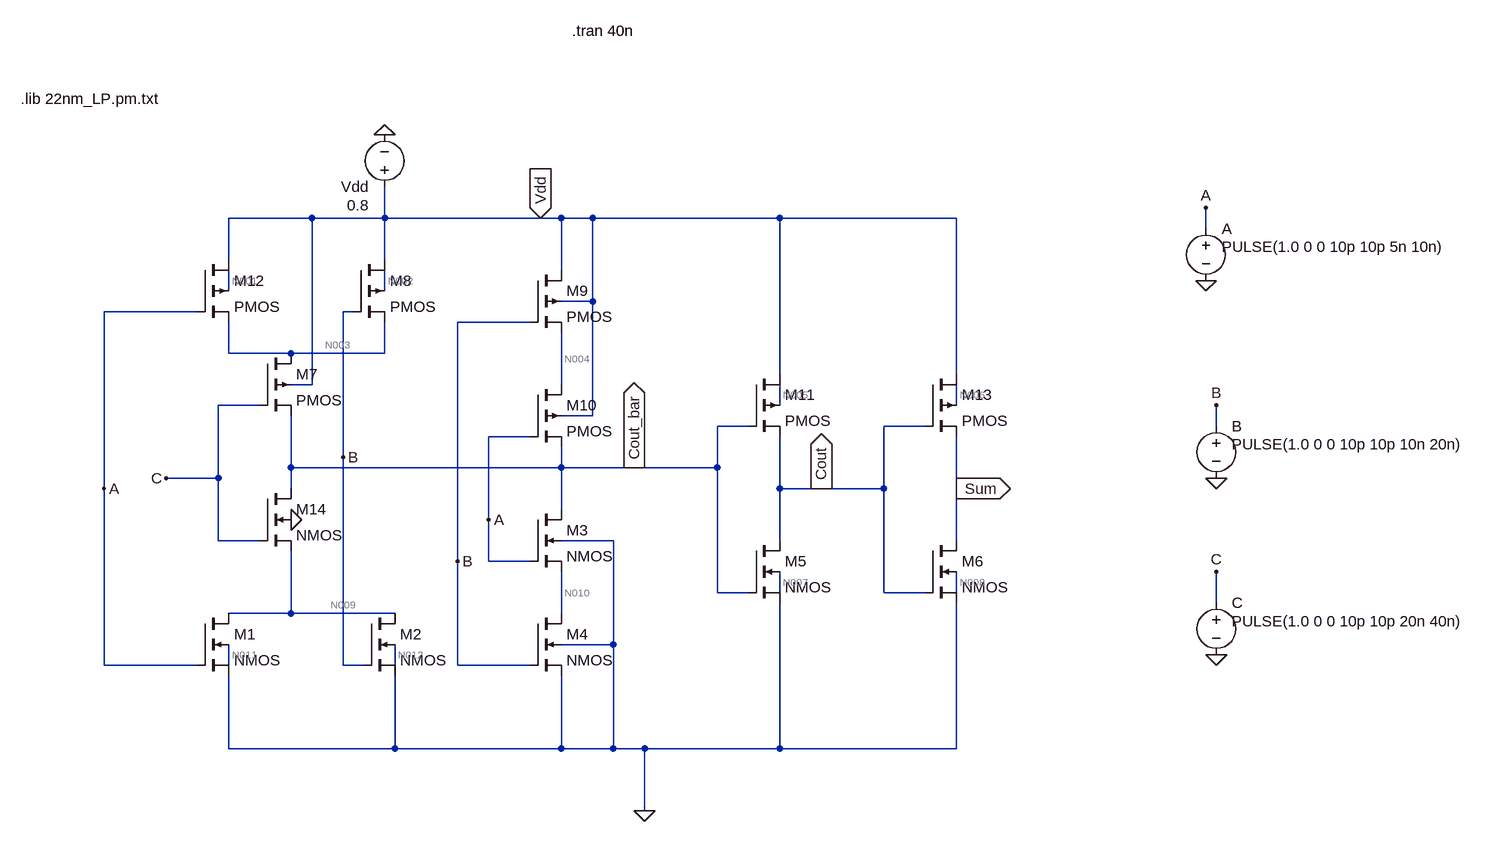
[diagram p0: schematic AMA2_22nm.asc]
AMA2_22nm.asc, the LTspice schematic file:
Version 4
SHEET 1 1044 692
WIRE -752 -240 -880 -240
WIRE -640 -240 -640 -288
WIRE -640 -240 -752 -240
WIRE -400 -240 -640 -240
WIRE -368 -240 -400 -240
WIRE -320 -240 -368 -240
WIRE -32 -240 -320 -240
WIRE 240 -240 -32 -240
WIRE 624 -224 624 -256
WIRE -880 -176 -880 -240
WIRE -640 -176 -640 -240
WIRE -368 -160 -368 -240
WIRE -880 -128 -880 -160
WIRE -640 -128 -640 -160
WIRE -320 -112 -320 -240
WIRE -320 -112 -368 -112
WIRE -928 -96 -1072 -96
WIRE -688 -96 -704 -96
WIRE -416 -80 -528 -80
WIRE -880 -32 -880 -80
WIRE -784 -32 -880 -32
WIRE -640 -32 -640 -80
WIRE -640 -32 -784 -32
WIRE -32 0 -32 -240
WIRE 240 0 240 -240
WIRE -752 16 -752 -240
WIRE -752 16 -784 16
WIRE -368 16 -368 -64
WIRE -832 48 -896 48
WIRE -32 48 -32 16
WIRE 240 48 240 16
WIRE -320 64 -320 -112
WIRE -320 64 -368 64
WIRE -80 80 -128 80
WIRE 192 80 128 80
WIRE 640 80 640 48
WIRE -416 96 -480 96
WIRE -704 128 -704 -96
WIRE -784 144 -784 64
WIRE -368 144 -368 112
WIRE -368 144 -784 144
WIRE -256 144 -368 144
WIRE -128 144 -128 80
WIRE -128 144 -256 144
WIRE -896 160 -896 48
WIRE -896 160 -976 160
WIRE -1072 176 -1072 -96
WIRE -784 176 -784 144
WIRE -32 176 -32 96
WIRE 32 176 -32 176
WIRE 128 176 128 80
WIRE 128 176 32 176
WIRE 240 176 240 96
WIRE -368 208 -368 144
WIRE -480 224 -480 96
WIRE -896 256 -896 160
WIRE -832 256 -896 256
WIRE -288 256 -368 256
WIRE -32 256 -32 176
WIRE 240 256 240 176
WIRE -528 288 -528 -80
WIRE -480 288 -480 224
WIRE -416 288 -480 288
WIRE -128 336 -128 144
WIRE -80 336 -128 336
WIRE -32 336 -32 304
WIRE 128 336 128 176
WIRE 192 336 128 336
WIRE 240 336 240 304
WIRE 640 352 640 304
WIRE -784 368 -784 272
WIRE -784 368 -880 368
WIRE -624 368 -784 368
WIRE -368 368 -368 304
WIRE -288 416 -288 256
WIRE -288 416 -368 416
WIRE -1072 448 -1072 176
WIRE -928 448 -1072 448
WIRE -880 448 -880 416
WIRE -704 448 -704 128
WIRE -672 448 -704 448
WIRE -624 448 -624 416
WIRE -528 448 -528 288
WIRE -416 448 -528 448
WIRE -880 576 -880 464
WIRE -624 576 -624 464
WIRE -624 576 -880 576
WIRE -368 576 -368 464
WIRE -368 576 -624 576
WIRE -288 576 -288 416
WIRE -288 576 -368 576
WIRE -240 576 -288 576
WIRE -32 576 -32 352
WIRE -32 576 -240 576
WIRE 240 576 240 352
WIRE 240 576 -32 576
WIRE -240 672 -240 576
FLAG -240 672 0
FLAG -256 144 Cout_bar
IOPIN -256 144 Out
FLAG 240 176 Sum
IOPIN 240 176 Out
FLAG 624 -144 0
FLAG 640 160 0
FLAG 640 432 0
FLAG 624 -256 A
FLAG 640 48 B
FLAG 640 304 C
FLAG -976 160 C
FLAG -400 -240 Vdd
IOPIN -400 -240 In
FLAG -1072 176 A
FLAG -704 128 B
FLAG -528 288 B
FLAG -480 224 A
FLAG -640 -368 0
FLAG -784 224 0
FLAG 32 176 Cout
IOPIN 32 176 Out
SYMBOL pmos4 -928 -176 R0
SYMATTR InstName M12
SYMATTR Value2 l=22n w=88n
SYMBOL nmos4 -832 176 R0
SYMATTR InstName M14
SYMATTR Value2 l=22n w=44n
SYMBOL voltage 624 -240 R0
WINDOW 3 24 44 Left 2
WINDOW 123 0 0 Left 0
WINDOW 39 0 0 Left 0
SYMATTR Value PULSE(1.0 0 0 10p 10p 5n 10n)
SYMATTR InstName A
SYMBOL voltage 640 64 R0
WINDOW 3 24 44 Left 2
WINDOW 123 0 0 Left 0
WINDOW 39 0 0 Left 0
SYMATTR Value PULSE(1.0 0 0 10p 10p 10n 20n)
SYMATTR InstName B
SYMBOL voltage 640 336 R0
WINDOW 3 24 44 Left 2
WINDOW 123 0 0 Left 0
WINDOW 39 0 0 Left 0
SYMATTR Value PULSE(1.0 0 0 10p 10p 20n 40n)
SYMATTR InstName C
SYMBOL voltage -640 -272 R180
WINDOW 3 24 -12 Left 2
WINDOW 123 0 0 Left 0
WINDOW 39 0 0 Left 0
SYMATTR Value 0.8
SYMATTR InstName Vdd
SYMBOL pmos4 -832 -32 R0
SYMATTR InstName M7
SYMATTR Value2 l=22n w=88n
SYMBOL pmos4 -688 -176 R0
SYMATTR InstName M8
SYMATTR Value2 l=22n w=88n
SYMBOL pmos4 -416 -160 R0
SYMATTR InstName M9
SYMATTR Value2 l=22n w=88n
SYMBOL pmos4 -416 16 R0
SYMATTR InstName M10
SYMATTR Value2 l=22n w=88n
SYMBOL pmos4 -80 0 R0
SYMATTR InstName M11
SYMATTR Value2 l=22n w=88n
SYMBOL pmos4 192 0 R0
SYMATTR InstName M13
SYMATTR Value2 l=22n w=88n
SYMBOL nmos4 -928 368 R0
SYMATTR InstName M1
SYMATTR Value2 l=22n w=44n
SYMBOL nmos4 -672 368 R0
SYMATTR InstName M2
SYMATTR Value2 l=22n w=44n
SYMBOL nmos4 -416 208 R0
SYMATTR InstName M3
SYMATTR Value2 l=22n w=44n
SYMBOL nmos4 -416 368 R0
SYMATTR InstName M4
SYMATTR Value2 l=22n w=44n
SYMBOL nmos4 -80 256 R0
SYMATTR InstName M5
SYMATTR Value2 l=22n w=44n
SYMBOL nmos4 192 256 R0
SYMATTR InstName M6
SYMATTR Value2 l=22n w=44n
TEXT -1200 -424 Left 2 !.lib 22nm_LP.pm.txt
TEXT -352 -528 Left 2 !.tran 40n

The netlist it stands for:
* AMA2_22nm.asc
M12 Vdd A N003 N001 PMOS l=22n w=88n
M14 Cout_bar C N009 0 NMOS l=22n w=44n
V§A A 0 PULSE(1.0 0 0 10p 10p 5n 10n)
V§B B 0 PULSE(1.0 0 0 10p 10p 10n 20n)
V§C C 0 PULSE(1.0 0 0 10p 10p 20n 40n)
Vdd Vdd 0 0.8
M7 N003 C Cout_bar Vdd PMOS l=22n w=88n
M8 Vdd B N003 N002 PMOS l=22n w=88n
M9 Vdd B N004 Vdd PMOS l=22n w=88n
M10 N004 A Cout_bar Vdd PMOS l=22n w=88n
M11 Vdd Cout_bar Cout N005 PMOS l=22n w=88n
M13 Vdd Cout Sum N006 PMOS l=22n w=88n
M1 N009 A 0 N011 NMOS l=22n w=44n
M2 N009 B 0 N012 NMOS l=22n w=44n
M3 Cout_bar A N010 0 NMOS l=22n w=44n
M4 N010 B 0 0 NMOS l=22n w=44n
M5 Cout Cout_bar 0 N007 NMOS l=22n w=44n
M6 Sum Cout 0 N008 NMOS l=22n w=44n
.model NMOS NMOS
.model PMOS PMOS
.lib standard.mos
.lib 22nm_LP.pm.txt
.tran 40n
.backanno
.end

* Results of the author's LTspice run, read from the files saved beside the schematic
* Operating Point, zero values left out:
*   V(vdd) = 800 mV
*   V(a) = 1 V
*   V(n003) = 704.8 mV
*   V(n001) = 694.6 mV
*   V(cout_bar) = 404.5 nV
*   V(c) = 1 V
*   V(n009) = 255.3 nV
*   V(b) = 1 V
*   V(n002) = 694.6 mV
*   V(n004) = 690.1 mV
*   V(cout) = 799.9 mV
*   V(n005) = 677.6 mV
*   V(sum) = 111.2 µV
*   V(n006) = 675.4 mV
*   V(n011) = 175.7 mV
*   V(n012) = 175.7 mV
*   V(n010) = 298.6 nV
*   V(n007) = 247.2 mV
*   V(n008) = 62.99 mV
*   Id(M6) = 20.33 nA
*   Ig(M6) = 14.22 pA
*   Is(M6) = -20.35 nA
*   Id(M5) = 19.67 nA
*   Ig(M5) = -9.184 pA
*   Is(M5) = -19.66 nA
*   Id(M4) = 41.15 pA
*   Ig(M4) = 51.03 pA
*   Ib(M4) = -11.81 pA
*   Is(M4) = -80.37 pA
*   Id(M3) = 1.92 pA
*   Ig(M3) = 51.03 pA
*   Ib(M3) = -11.81 pA
*   Is(M3) = -41.15 pA
*   Id(M2) = 24.98 pA
*   Ig(M2) = 48.6 pA
*   Is(M2) = -73.4 pA
*   Id(M1) = 24.98 pA
*   Ig(M1) = 48.6 pA
*   Is(M1) = -73.4 pA
*   Id(M14) = 10.73 pA
*   Ig(M14) = 51.03 pA
*   Ib(M14) = -11.81 pA
*   Is(M14) = -49.96 pA
*   Id(M13) = 20.33 nA
*   Is(M13) = -20.33 nA
*   Id(M11) = 19.69 nA
*   Is(M11) = -19.69 nA
*   Is(M10) = -1.206 pA
*   Id(M8) = 1.024 pA
*   Is(M7) = -1.566 pA
*   Id(M12) = 1.024 pA
*   I(Vdd) = -40.03 nA
*   I(C) = -51.04 pA
*   I(B) = -99.63 pA
*   I(A) = -99.63 pA
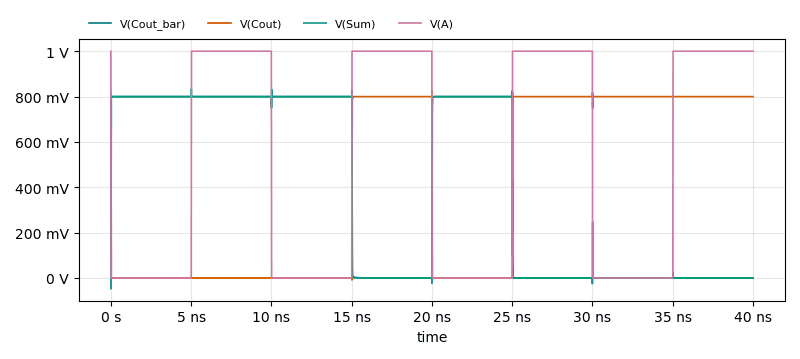
[diagram p1: Transient Analysis of AMA2_22nm.asc, plotted from the saved traces]
* Transient Analysis, 1 run:
*   V(Cout_bar): min -48.04 mV, max 834.2 mV, average 400.5 mV, rms 565.7 mV, last 3.794 µV
*   V(Cout): min -8.375 mV, max 827.7 mV, average 399.6 mV, rms 565.1 mV, last 799.9 mV
*   V(Sum): min -7.019 mV, max 814.4 mV, average 400.5 mV, rms 565.8 mV, last 111.7 µV
*   V(A): min 0 V, max 1 V, average 499 mV, rms 706.2 mV, last 1 V